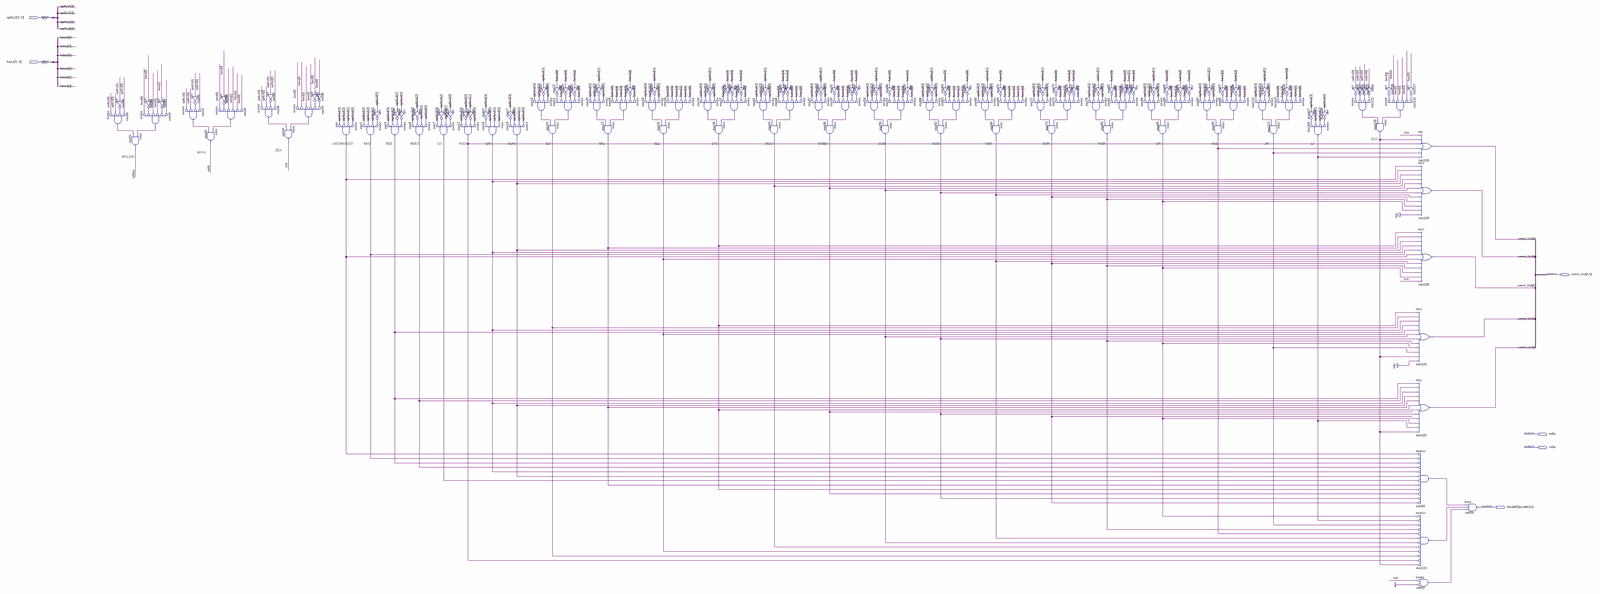
[diagram p0: schematic sheet, whole]
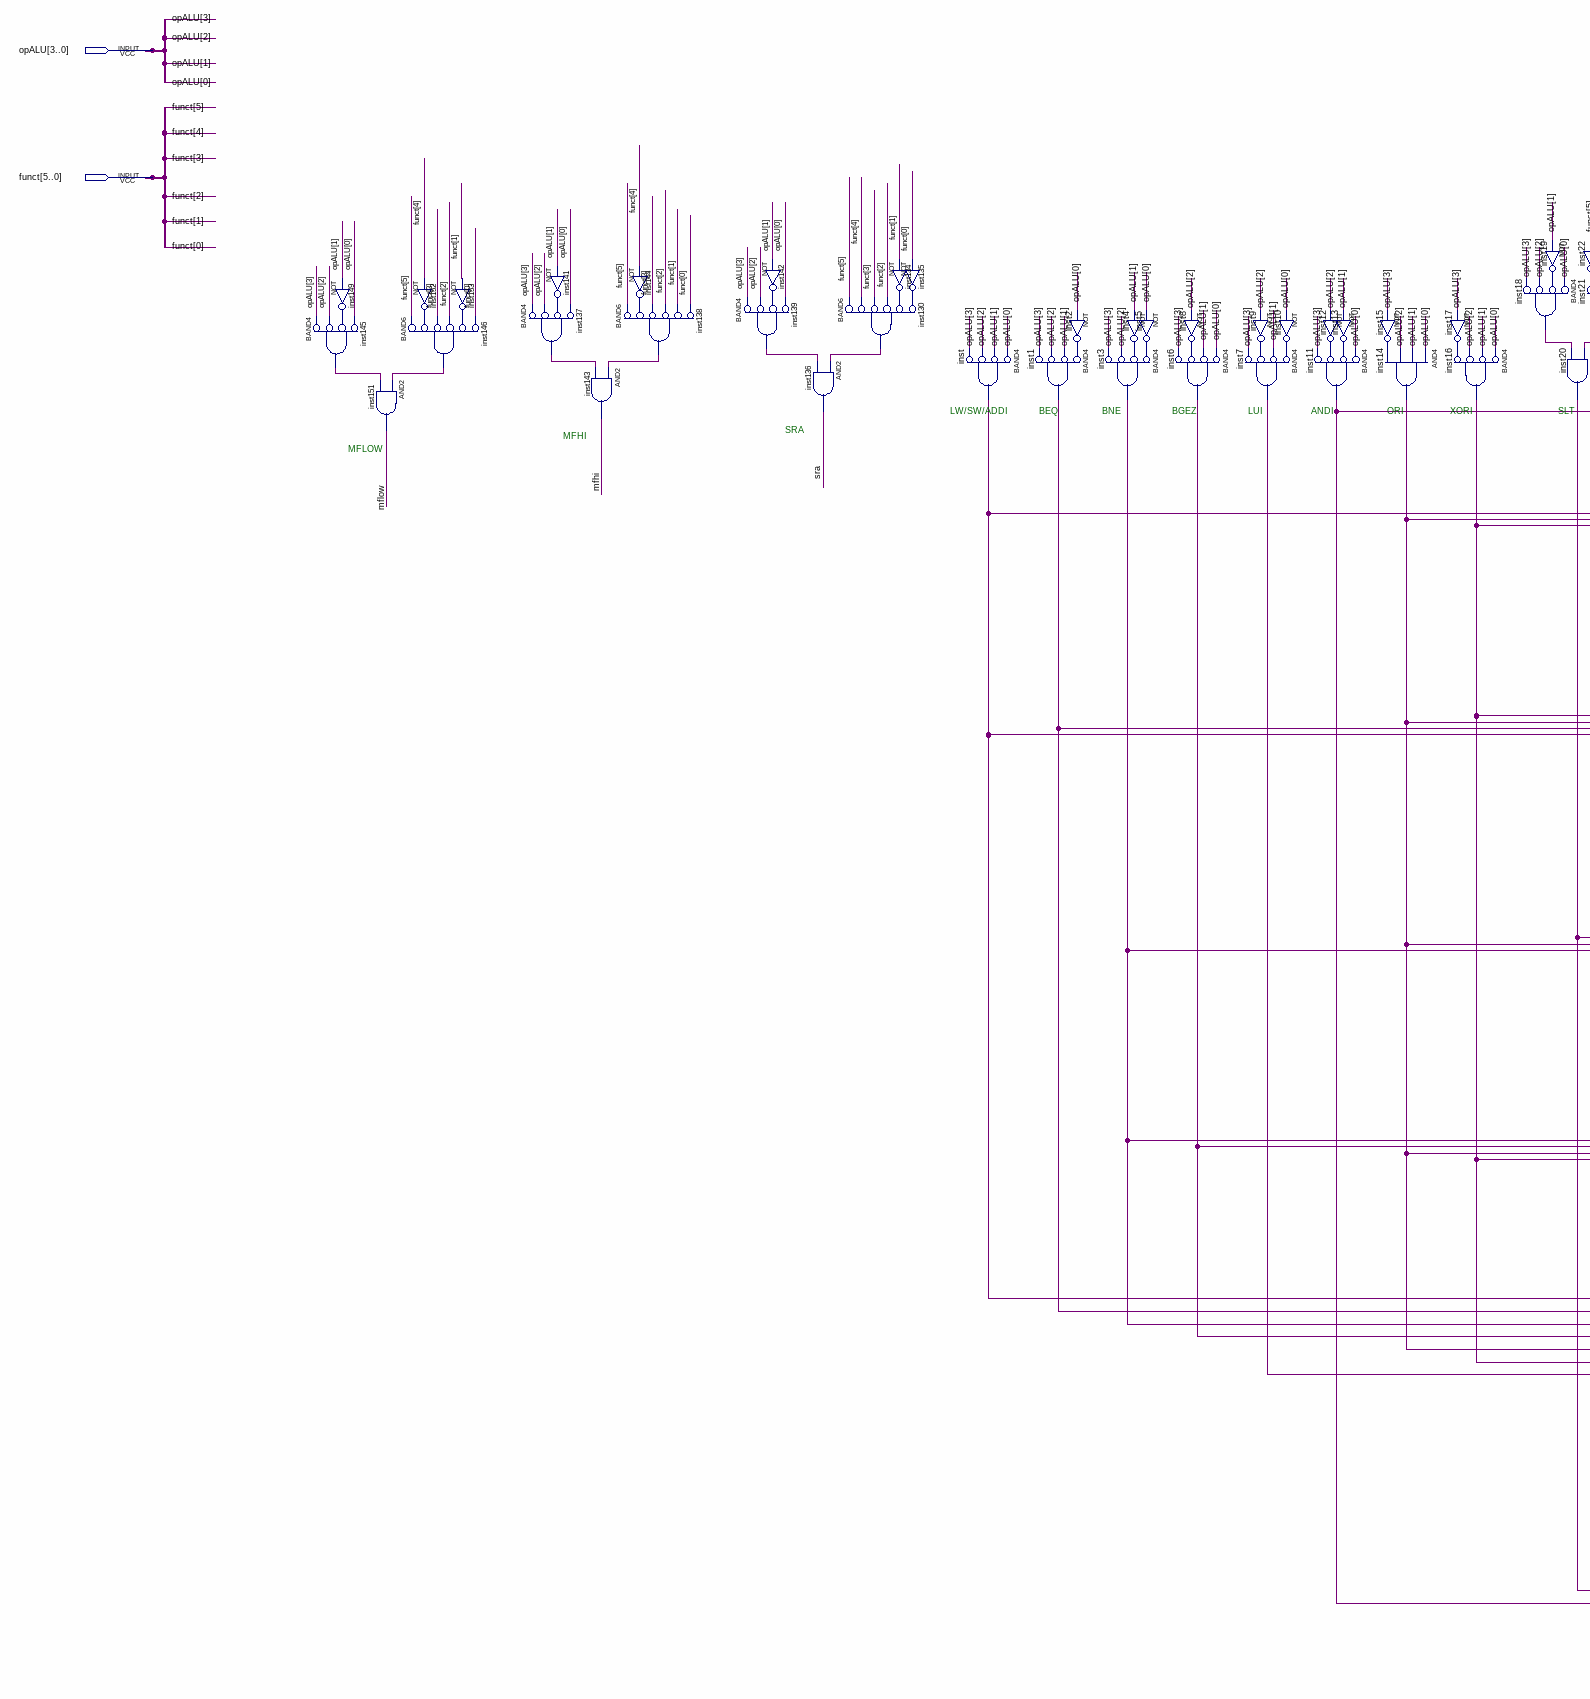
[diagram p1: schematic sheet, left part]
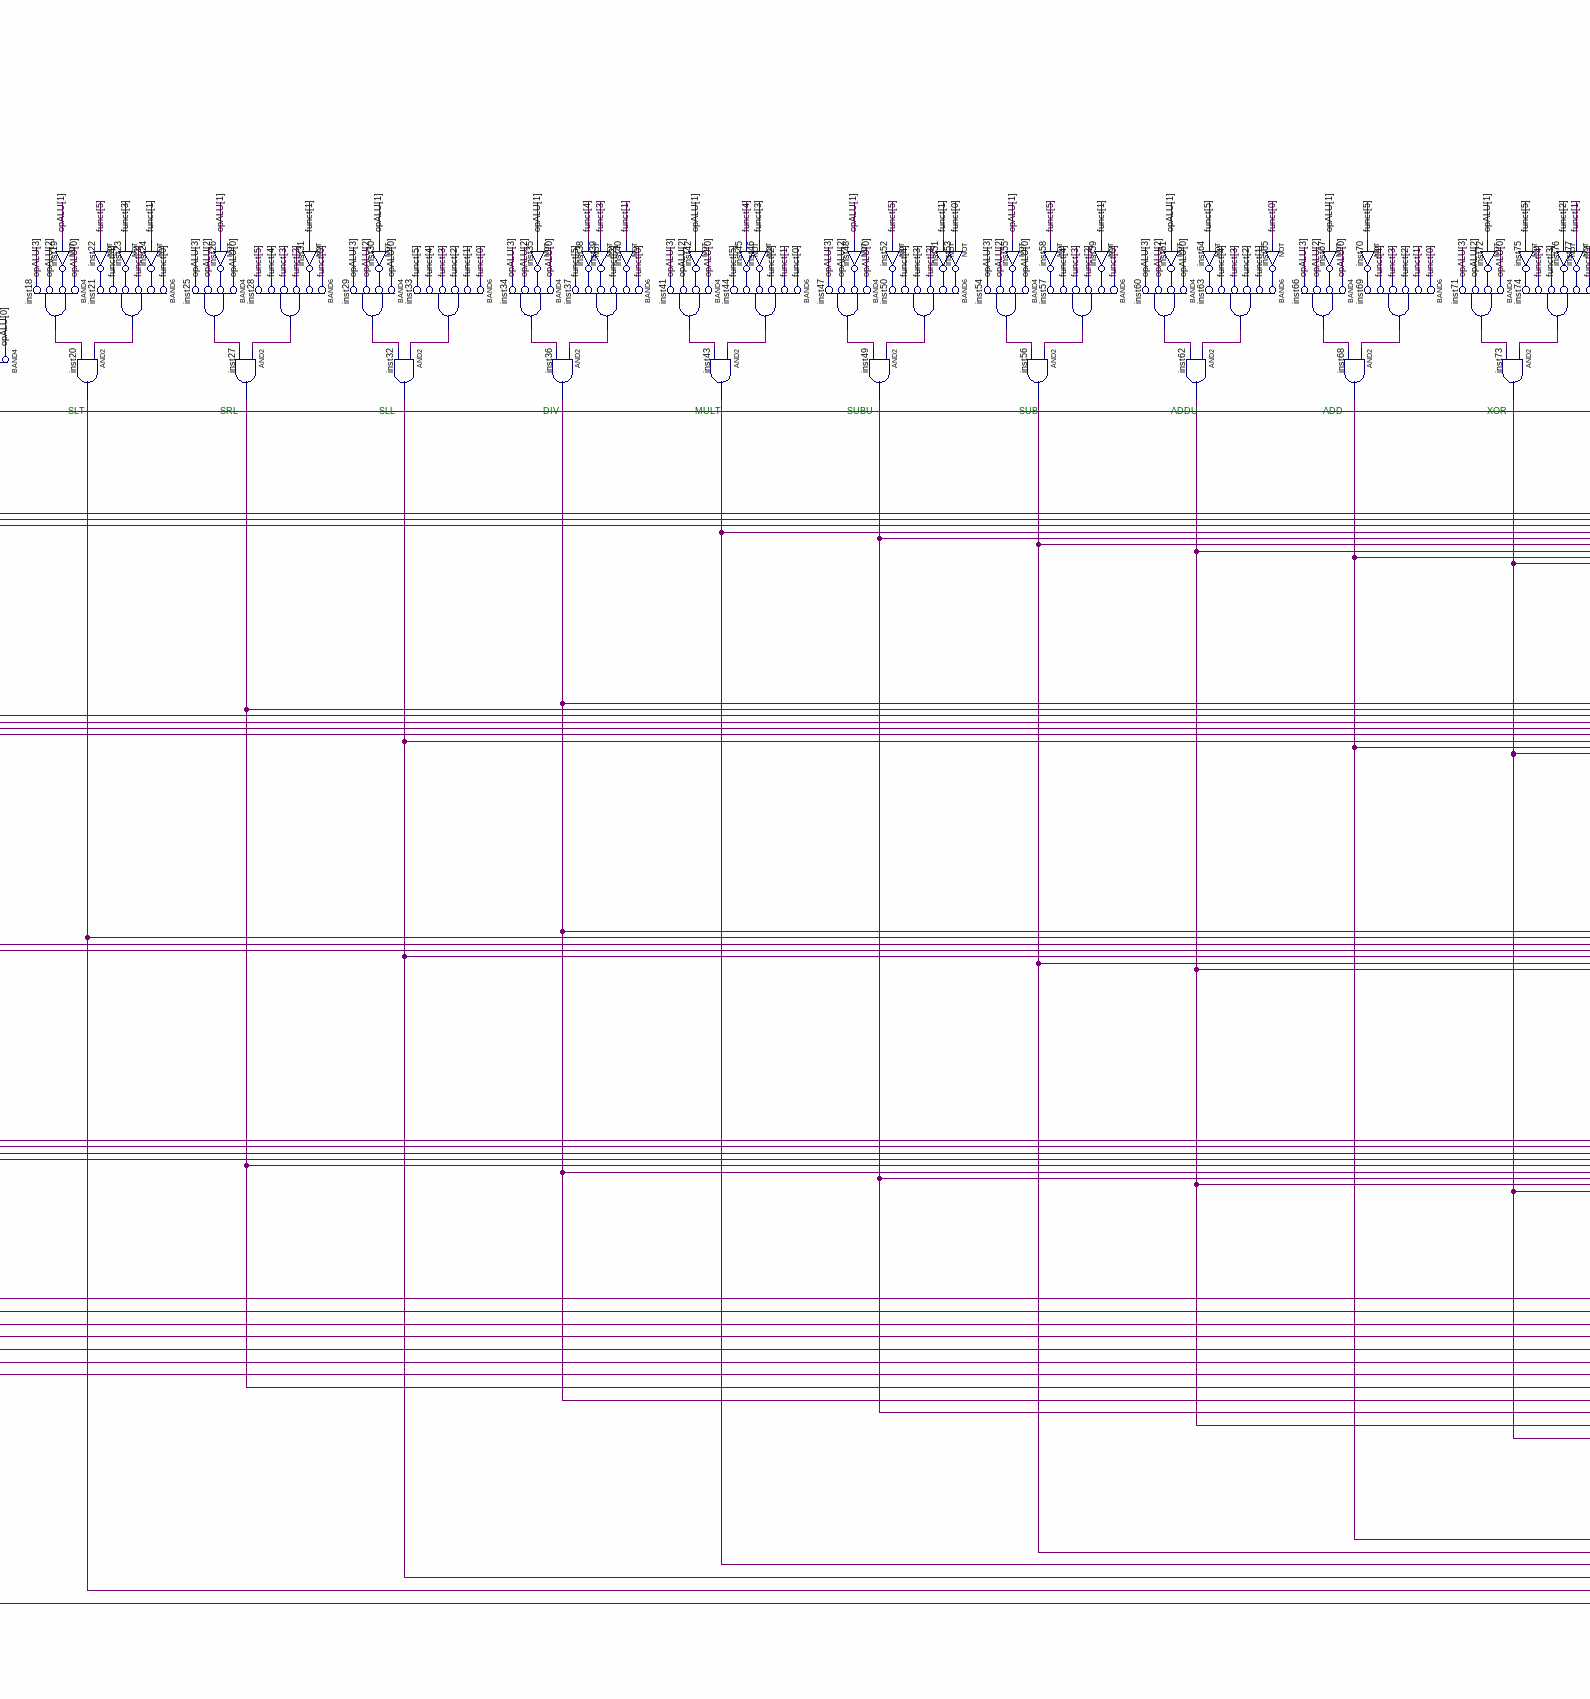
[diagram p2: schematic sheet, centre part]
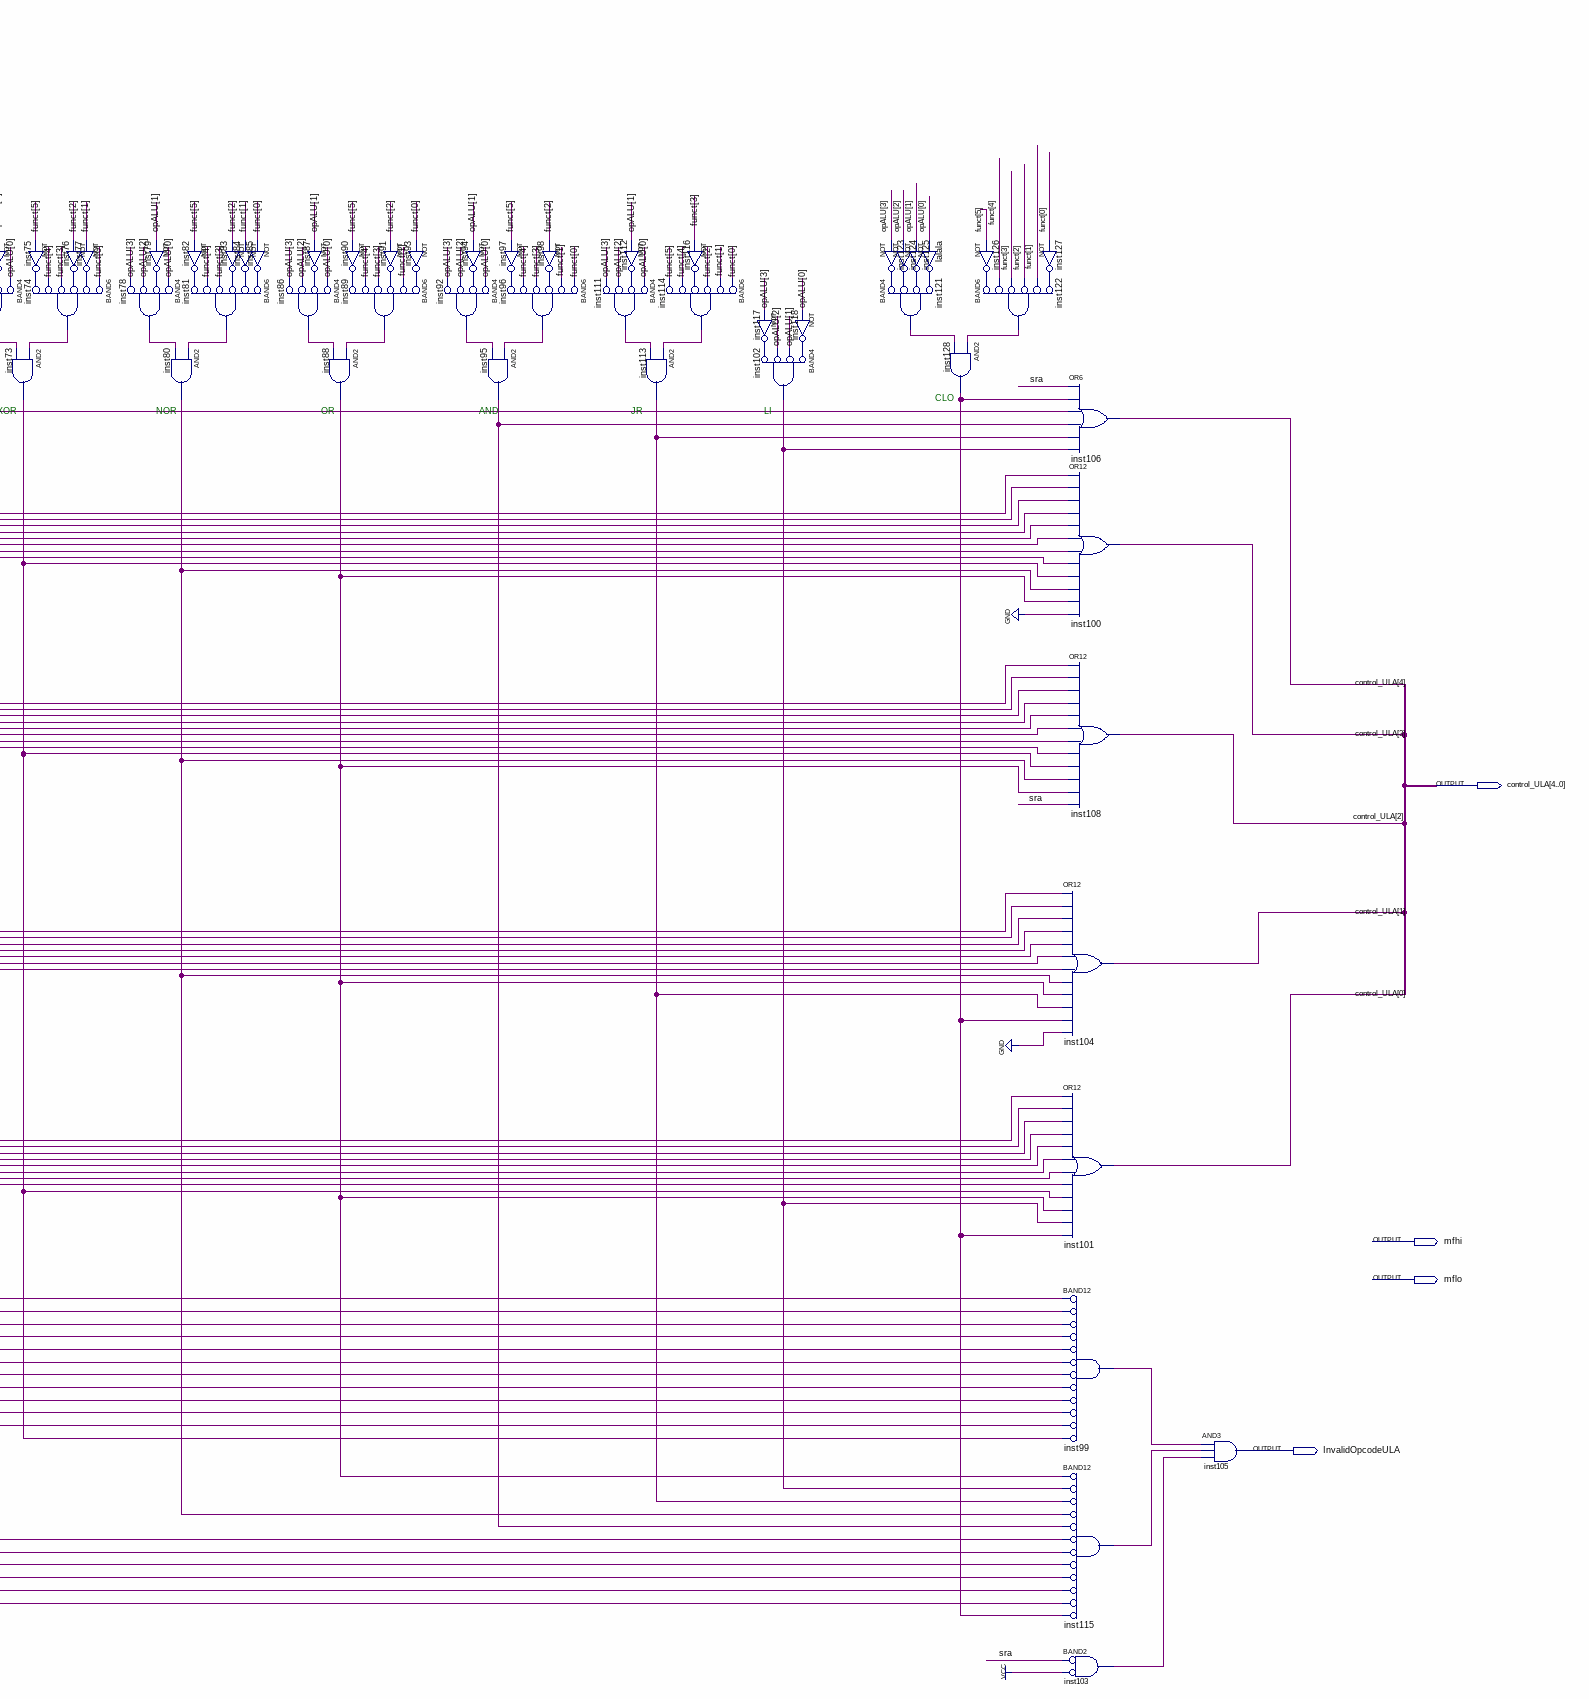
[diagram p3: schematic sheet, right part]
// Quartus schematic controlULA.bdf as structural Verilog: 142 symbols, 6 pins
module controlULA (
  input  [3:0] opALU,
  input  [5:0] funct,
  output [4:0] control_ULA,
  output mfhi,
  output mflo,
  output InvalidOpcodeULA
);

  wire inst1_out, inst2_out, inst3_out, inst4_out, inst5_out, inst6_out, inst7_out, inst8_out, inst9_out,
       inst10_out, inst11_out, inst12_out, inst13_out, inst14_out, inst15_out, inst16_out, inst17_out,
       inst18_out, inst19_out, inst20_out, inst21_out, inst22_out, inst23_out, inst24_out, inst25_out,
       inst26_out, inst27_out, inst28_out, inst29_out, inst30_out, inst31_out, inst32_out, inst33_out,
       inst34_out, inst35_out, inst36_out, inst37_out, inst38_out, inst39_out, inst40_out, inst41_out,
       inst42_out, inst43_out, inst44_out, inst45_out, inst46_out, inst47_out, inst48_out, inst49_out,
       inst50_out, inst51_out, inst52_out, inst53_out, inst54_out, inst55_out, inst56_out, inst57_out,
       inst58_out, inst59_out, inst60_out, inst61_out, inst62_out, inst63_out, inst64_out, inst65_out,
       inst66_out, inst67_out, inst68_out, inst69_out, inst70_out, inst71_out, inst72_out, inst73_out,
       inst74_out, inst75_out, inst76_out, inst77_out, inst78_out, inst79_out, inst80_out, inst81_out,
       inst82_out, inst83_out, inst84_out, inst85_out, inst86_out, inst87_out, inst88_out, inst89_out,
       inst90_out, inst91_out, inst92_out, inst93_out, inst94_out, inst95_out, inst96_out, inst97_out,
       inst98_out, inst99_out, inst102_out, inst103_out, inst111_out, inst112_out, inst113_out, inst114_out,
       inst115_out, inst116_out, inst117_out, inst118_out, inst121_out, inst122_out, inst123_out,
       inst124_out, inst125_out, inst126_out, inst127_out, inst128_out, inst130_out, inst134_out,
       inst135_out, inst137_out, inst138_out, inst139_out, inst141_out, inst142_out, inst144_out,
       inst145_out, inst146_out, inst149_out, inst152_out, inst153_out, inst_out, lalala_out, mflow, sra;

  not inst149 (inst149_out, opALU[1]);
  and inst145 (inst145_out, ~opALU[3], ~opALU[2], ~inst149_out, ~opALU[0]);  // BAND4
  and inst151 (mflow, inst146_out, inst145_out);
  not inst152 (inst152_out, funct[4]);
  and inst146 (inst146_out, ~funct[5], ~inst152_out, ~funct[3], ~funct[2], ~inst153_out, ~funct[0]);  // BAND6
  // NOT inst153 has open pins: IN=open, OUT=inst153_out
  and inst137 (inst137_out, ~opALU[3], ~opALU[2], ~inst141_out, ~opALU[0]);  // BAND4
  not inst141 (inst141_out, opALU[1]);
  and inst143 (mfhi, inst138_out, inst137_out);
  not inst144 (inst144_out, funct[4]);
  and inst138 (inst138_out, ~funct[5], ~inst144_out, ~funct[3], ~funct[2], ~funct[1], ~funct[0]);  // BAND6
  and inst139 (inst139_out, ~opALU[3], ~opALU[2], ~inst142_out, ~opALU[0]);  // BAND4
  not inst142 (inst142_out, opALU[1]);
  and inst130 (inst130_out, ~funct[5], ~funct[4], ~funct[3], ~funct[2], ~inst134_out, ~inst135_out);  // BAND6
  and inst136 (sra, inst130_out, inst139_out);
  not inst134 (inst134_out, funct[1]);
  not inst135 (inst135_out, funct[0]);
  and inst (inst_out, ~opALU[0], ~opALU[1], ~opALU[2], ~opALU[3]);  // BAND4
  and inst1 (inst1_out, ~inst2_out, ~opALU[1], ~opALU[2], ~opALU[3]);  // BAND4
  not inst2 (inst2_out, opALU[0]);
  and inst3 (inst3_out, ~inst5_out, ~inst4_out, ~opALU[2], ~opALU[3]);  // BAND4
  not inst4 (inst4_out, opALU[1]);
  not inst5 (inst5_out, opALU[0]);
  not inst8 (inst8_out, opALU[2]);
  and inst6 (inst6_out, ~opALU[0], ~opALU[1], ~inst8_out, ~opALU[3]);  // BAND4
  not inst9 (inst9_out, opALU[2]);
  and inst7 (inst7_out, ~inst10_out, ~opALU[1], ~inst9_out, ~opALU[3]);  // BAND4
  not inst10 (inst10_out, opALU[0]);
  not inst12 (inst12_out, opALU[2]);
  not inst13 (inst13_out, opALU[1]);
  and inst11 (inst11_out, ~opALU[0], ~inst13_out, ~inst12_out, ~opALU[3]);  // BAND4
  not inst15 (inst15_out, opALU[3]);
  and inst14 (inst14_out, opALU[0], opALU[1], opALU[2], inst15_out);
  not inst17 (inst17_out, opALU[3]);
  and inst16 (inst16_out, ~opALU[0], ~opALU[1], ~opALU[2], ~inst17_out);  // BAND4
  not inst19 (inst19_out, opALU[1]);
  and inst18 (inst18_out, ~opALU[0], ~inst19_out, ~opALU[2], ~opALU[3]);  // BAND4
  not inst22 (inst22_out, funct[5]);
  not inst23 (inst23_out, funct[3]);
  and inst21 (inst21_out, ~funct[0], ~inst24_out, ~funct[2], ~inst23_out, ~funct[4], ~inst22_out);  // BAND6
  and inst20 (inst20_out, inst21_out, inst18_out);
  not inst24 (inst24_out, funct[1]);
  not inst26 (inst26_out, opALU[1]);
  and inst25 (inst25_out, ~opALU[0], ~inst26_out, ~opALU[2], ~opALU[3]);  // BAND4
  and inst28 (inst28_out, ~funct[0], ~inst31_out, ~funct[2], ~funct[3], ~funct[4], ~funct[5]);  // BAND6
  and inst27 (inst27_out, inst28_out, inst25_out);
  not inst31 (inst31_out, funct[1]);
  not inst30 (inst30_out, opALU[1]);
  and inst29 (inst29_out, ~opALU[0], ~inst30_out, ~opALU[2], ~opALU[3]);  // BAND4
  and inst33 (inst33_out, ~funct[0], ~funct[1], ~funct[2], ~funct[3], ~funct[4], ~funct[5]);  // BAND6
  and inst32 (inst32_out, inst33_out, inst29_out);
  and inst34 (inst34_out, ~opALU[0], ~inst35_out, ~opALU[2], ~opALU[3]);  // BAND4
  not inst35 (inst35_out, opALU[1]);
  and inst37 (inst37_out, ~funct[0], ~inst40_out, ~funct[2], ~inst39_out, ~inst38_out, ~funct[5]);  // BAND6
  and inst36 (inst36_out, inst37_out, inst34_out);
  not inst38 (inst38_out, funct[4]);
  not inst39 (inst39_out, funct[3]);
  not inst40 (inst40_out, funct[1]);
  and inst41 (inst41_out, ~opALU[0], ~inst42_out, ~opALU[2], ~opALU[3]);  // BAND4
  not inst42 (inst42_out, opALU[1]);
  and inst44 (inst44_out, ~funct[0], ~funct[1], ~funct[2], ~inst46_out, ~inst45_out, ~funct[5]);  // BAND6
  and inst43 (inst43_out, inst44_out, inst41_out);
  not inst45 (inst45_out, funct[4]);
  not inst46 (inst46_out, funct[3]);
  and inst47 (inst47_out, ~opALU[0], ~inst48_out, ~opALU[2], ~opALU[3]);  // BAND4
  not inst48 (inst48_out, opALU[1]);
  and inst49 (inst49_out, inst50_out, inst47_out);
  not inst52 (inst52_out, funct[5]);
  and inst50 (inst50_out, ~inst53_out, ~inst51_out, ~funct[2], ~funct[3], ~funct[4], ~inst52_out);  // BAND6
  not inst51 (inst51_out, funct[1]);
  not inst53 (inst53_out, funct[0]);
  and inst54 (inst54_out, ~opALU[0], ~inst55_out, ~opALU[2], ~opALU[3]);  // BAND4
  not inst55 (inst55_out, opALU[1]);
  and inst56 (inst56_out, inst57_out, inst54_out);
  not inst58 (inst58_out, funct[5]);
  and inst57 (inst57_out, ~funct[0], ~inst59_out, ~funct[2], ~funct[3], ~funct[4], ~inst58_out);  // BAND6
  not inst59 (inst59_out, funct[1]);
  not inst61 (inst61_out, opALU[1]);
  and inst60 (inst60_out, ~opALU[0], ~inst61_out, ~opALU[2], ~opALU[3]);  // BAND4
  and inst62 (inst62_out, inst63_out, inst60_out);
  not inst64 (inst64_out, funct[5]);
  and inst63 (inst63_out, ~inst65_out, ~funct[1], ~funct[2], ~funct[3], ~funct[4], ~inst64_out);  // BAND6
  not inst65 (inst65_out, funct[0]);
  not inst67 (inst67_out, opALU[1]);
  and inst66 (inst66_out, ~opALU[0], ~inst67_out, ~opALU[2], ~opALU[3]);  // BAND4
  not inst70 (inst70_out, funct[5]);
  and inst69 (inst69_out, ~funct[0], ~funct[1], ~funct[2], ~funct[3], ~funct[4], ~inst70_out);  // BAND6
  and inst68 (inst68_out, inst69_out, inst66_out);
  not inst72 (inst72_out, opALU[1]);
  and inst71 (inst71_out, ~opALU[0], ~inst72_out, ~opALU[2], ~opALU[3]);  // BAND4
  not inst75 (inst75_out, funct[5]);
  and inst74 (inst74_out, ~funct[0], ~inst77_out, ~inst76_out, ~funct[3], ~funct[4], ~inst75_out);  // BAND6
  and inst73 (inst73_out, inst74_out, inst71_out);
  not inst76 (inst76_out, funct[2]);
  not inst77 (inst77_out, funct[1]);
  not inst79 (inst79_out, opALU[1]);
  and inst78 (inst78_out, ~opALU[0], ~inst79_out, ~opALU[2], ~opALU[3]);  // BAND4
  not inst82 (inst82_out, funct[5]);
  and inst81 (inst81_out, ~inst85_out, ~inst84_out, ~inst83_out, ~funct[3], ~funct[4], ~inst82_out);  // BAND6
  and inst80 (inst80_out, inst81_out, inst78_out);
  not inst83 (inst83_out, funct[2]);
  not inst84 (inst84_out, funct[1]);
  not inst85 (inst85_out, funct[0]);
  and inst86 (inst86_out, ~opALU[0], ~inst87_out, ~opALU[2], ~opALU[3]);  // BAND4
  not inst87 (inst87_out, opALU[1]);
  not inst90 (inst90_out, funct[5]);
  and inst89 (inst89_out, ~inst93_out, ~funct[1], ~inst91_out, ~funct[3], ~funct[4], ~inst90_out);  // BAND6
  and inst88 (inst88_out, inst89_out, inst86_out);
  not inst91 (inst91_out, funct[2]);
  not inst93 (inst93_out, funct[0]);
  and inst92 (inst92_out, ~opALU[0], ~inst94_out, ~opALU[2], ~opALU[3]);  // BAND4
  not inst94 (inst94_out, opALU[1]);
  not inst97 (inst97_out, funct[5]);
  and inst96 (inst96_out, ~funct[0], ~funct[1], ~inst98_out, ~funct[3], ~funct[4], ~inst97_out);  // BAND6
  and inst95 (inst95_out, inst96_out, inst92_out);
  not inst98 (inst98_out, funct[2]);
  and inst111 (inst111_out, ~opALU[0], ~inst112_out, ~opALU[2], ~opALU[3]);  // BAND4
  not inst112 (inst112_out, opALU[1]);
  and inst113 (inst113_out, inst114_out, inst111_out);
  not inst116 (inst116_out, funct[3]);
  and inst114 (inst114_out, ~funct[0], ~funct[1], ~funct[2], ~inst116_out, ~funct[4], ~funct[5]);  // BAND6
  not inst117 (inst117_out, opALU[3]);
  and inst102 (inst102_out, ~inst118_out, ~opALU[1], ~opALU[2], ~inst117_out);  // BAND4
  not inst118 (inst118_out, opALU[0]);
  not inst123 (inst123_out, opALU[3]);
  not inst124 (inst124_out, opALU[2]);
  not inst125 (inst125_out, opALU[1]);
  and inst121 (inst121_out, ~inst123_out, ~inst124_out, ~inst125_out, ~lalala_out);  // BAND4
  not lalala (lalala_out, opALU[0]);
  and inst128 (inst128_out, inst122_out, inst121_out);
  not inst126 (inst126_out, funct[5]);
  and inst122 (inst122_out, ~inst126_out, ~funct[4], ~funct[3], ~funct[2], ~funct[1], ~inst127_out);  // BAND6
  not inst127 (inst127_out, funct[0]);
  or inst106 (control_ULA[4], sra, inst128_out, inst11_out, inst95_out, inst113_out, inst102_out);
  or inst100 (control_ULA[3], inst_out, inst14_out, inst16_out, inst43_out, inst49_out, inst56_out, inst62_out, inst68_out, inst73_out, inst80_out, inst88_out, 1'b0);
  or inst108 (control_ULA[2], inst36_out, inst27_out, inst16_out, inst14_out, inst1_out, inst_out, inst32_out, inst68_out, inst73_out, inst80_out, inst88_out, sra);
  or inst104 (control_ULA[1], inst36_out, inst20_out, inst14_out, inst3_out, inst32_out, inst56_out, inst62_out, inst80_out, inst88_out, inst113_out, inst128_out, 1'b0);
  or inst101 (control_ULA[0], inst3_out, inst6_out, inst14_out, inst16_out, inst27_out, inst36_out, inst49_out, inst62_out, inst73_out, inst88_out, inst102_out, inst128_out);
  and inst99 (inst99_out, ~inst_out, ~inst1_out, ~inst3_out, ~inst6_out, ~inst14_out, ~inst16_out, ~inst7_out, ~inst27_out, ~inst36_out, ~inst49_out, ~inst62_out, ~inst73_out);  // BAND12
  and inst115 (inst115_out, ~inst88_out, ~inst102_out, ~inst113_out, ~inst80_out, ~inst95_out, ~inst68_out, ~inst56_out, ~inst43_out, ~inst32_out, ~inst20_out, ~inst11_out, ~inst128_out);  // BAND12
  and inst103 (inst103_out, ~sra, ~1'b1);  // BAND2
  and inst105 (InvalidOpcodeULA, inst99_out, inst115_out, inst103_out);

  // Notes on the sheet:
  //   CLO
  //   LW/SW/ADDI
  //   BEQ
  //   BNE
  //   BGEZ
  //   LUI
  //   ANDI
  //   ORI
  //   XORI
  //   SLT
  //   SRL
  //   SLL
  //   DIV
  //   MULT
  //   SUBU
  //   SUB
  //   ADDU
  //   ADD
  //   XOR
  //   NOR
  //   OR
  //   AND
  //   JR
  //   LI
  //   SRA
  //   MFHI
  //   MFLOW
endmodule
